# Altium project DSD_DTU.PrjPcb
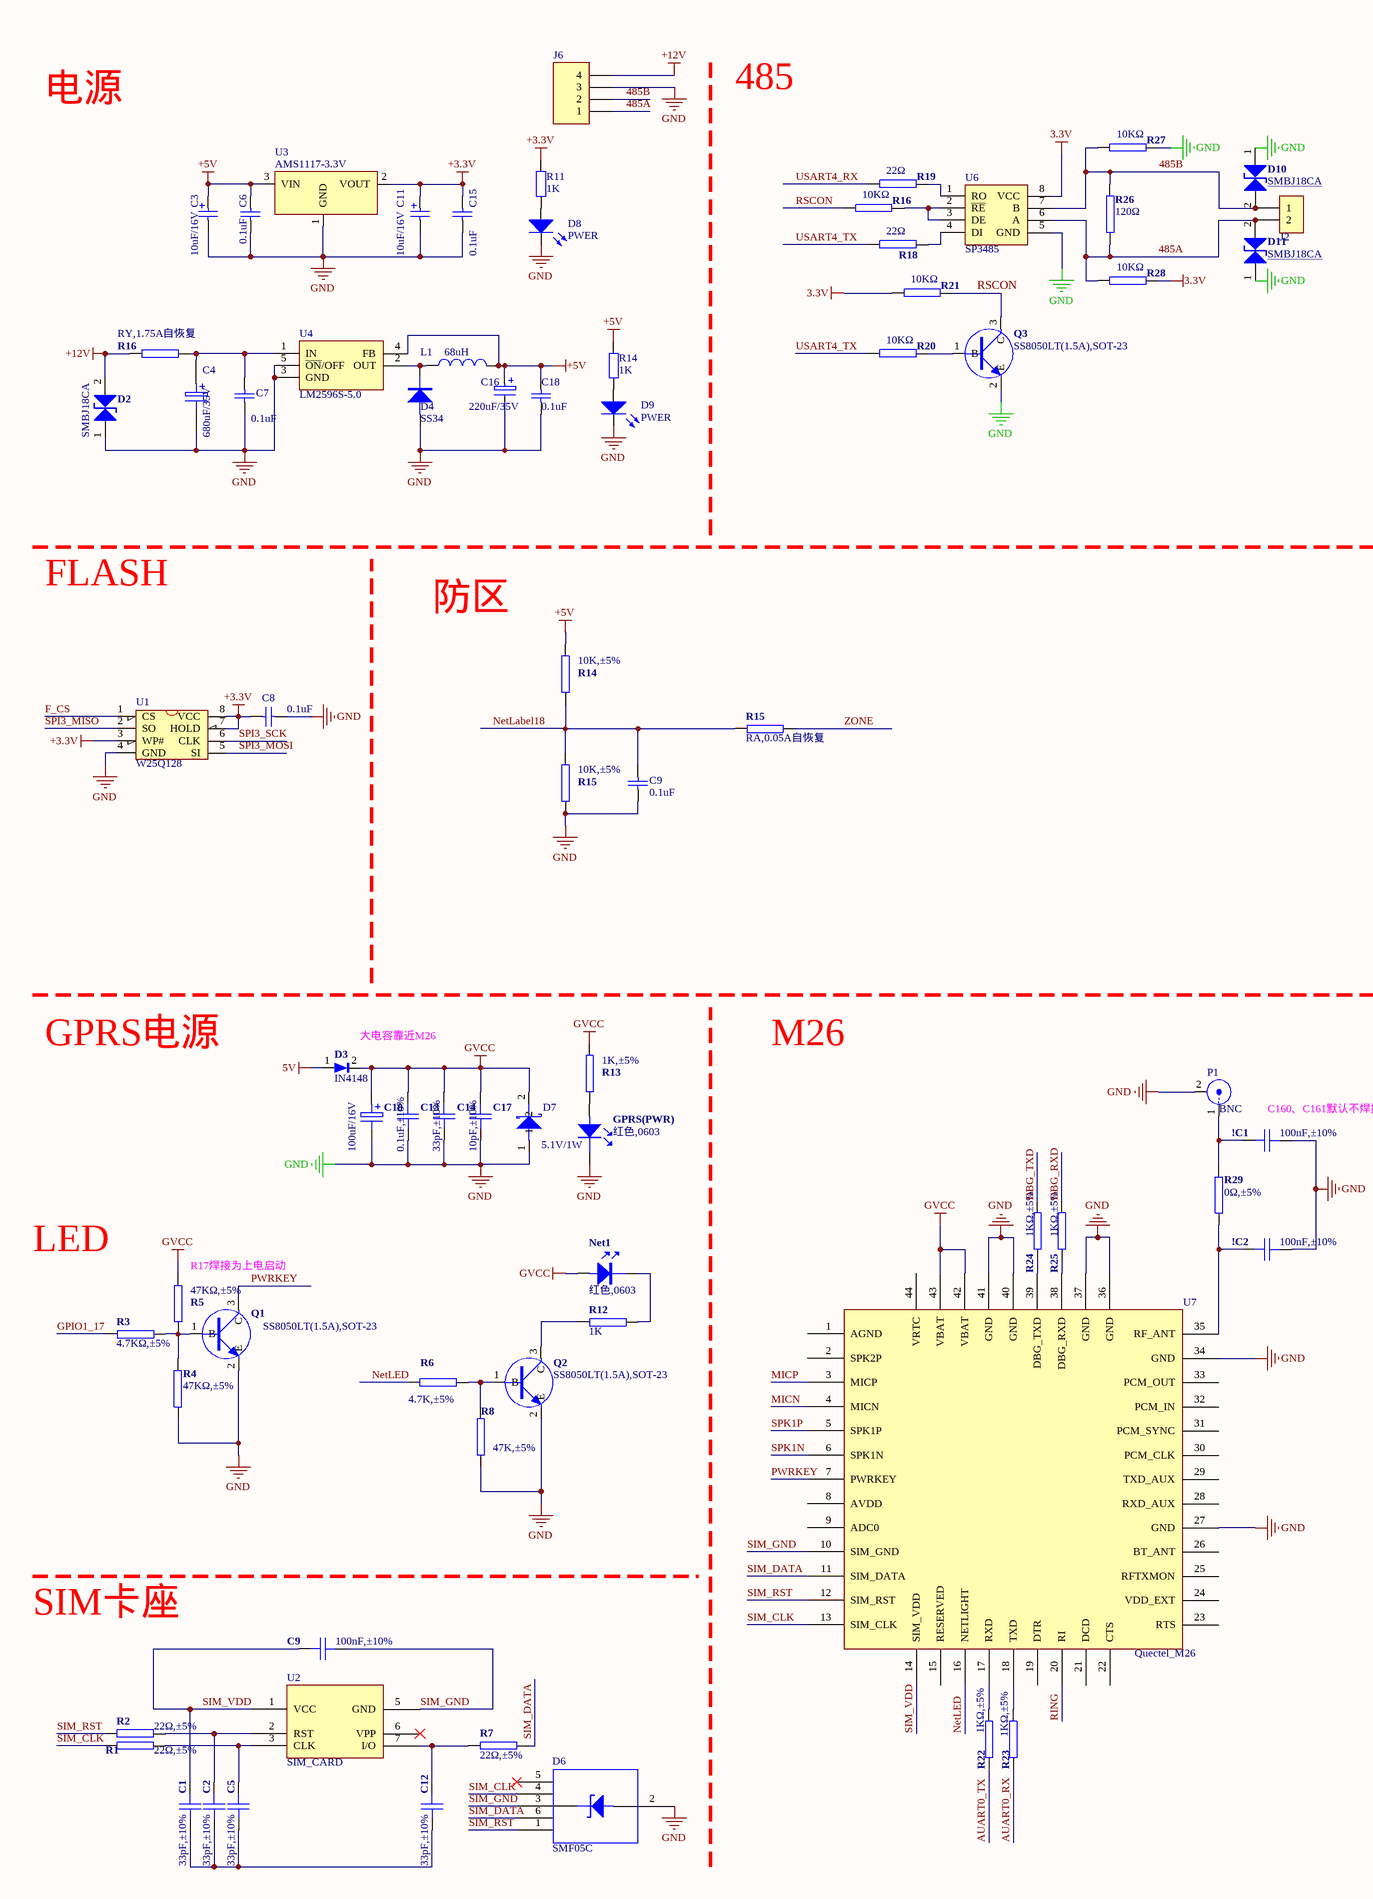
[diagram p0: DSD_DTU.SchDoc, left]
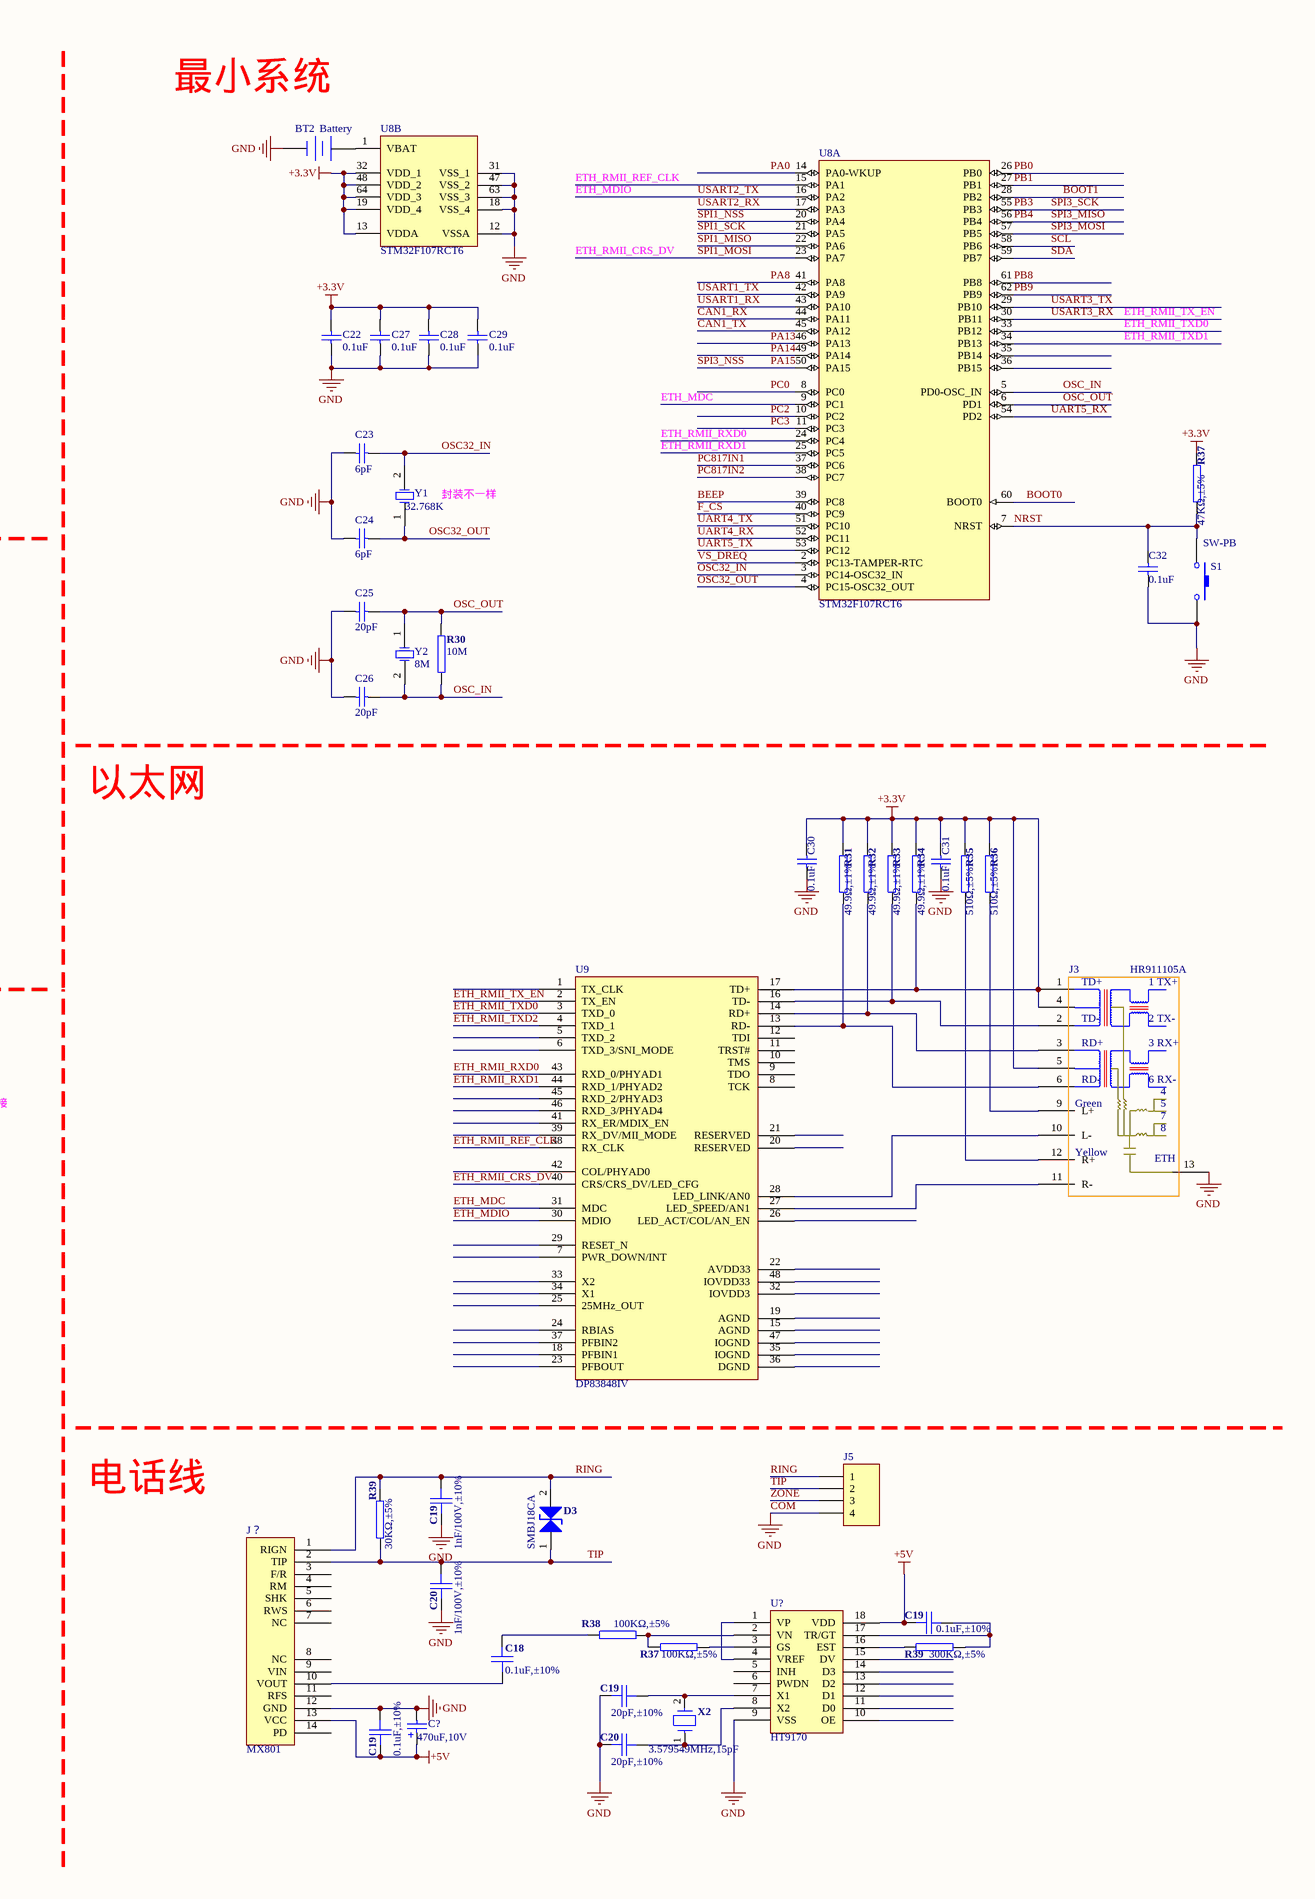
[diagram p1: DSD_DTU.SchDoc, right]
1 sheet, 117 parts. Net scope: global (net labels, ports and power ports of the same name join across sheets).

## Sheet DSD_DTU.SchDoc: DSD_DTU
size A2; Revision: V1.0

### Parts
(Parts that share a designator on the sheet are numbered #1, #2 ... from top to bottom, then left to right.)
!C1  100nF,±10%  [0603C]
!C2  100nF,±10%  [0603C]
BT2  Battery  [BATM]
C1  33pF,±10%  [0603C]
C2  33pF,±10%  [0603C]
C3  10uF/16V  [CAP6.3X7.7]
C4  680uF/35V  [CAPR5-4X5]
C5  33pF,±10%  [0603C]
C6  0.1uF  [0603C]
C7  0.1uF  [0603C]
C8  0.1uF  [0603C]
C9#1  0.1uF  [0603C]
C9#2  100nF,±10%  [0603C]
C10  100uF/16V  [CAPPRD250W45D630H800P]
C11  10uF/16V  [CAP6.3X7.7]
C12  33pF,±10%  [0603C]
C13  0.1uF,±10%  [0603C]
C14  33pF,±10%  [0603C]
C15  0.1uF  [0603C]
C16  220uF/35V  [CAPR5-4X5]
C17  10pF,±10%  [0603C]
C18#1  0.1uF  [0603C]
C18#2  0.1uF,±10%  [0603C]
C19#1  1nF/100V,±10%  [0603C]
C19#2  0.1uF,±10%  [0603C]
C19#3  20pF,±10%  [0603C]
C19#4  0.1uF,±10%  [0603C]
C20#1  1nF/100V,±10%  [0603C]
C20#2  20pF,±10%  [0603C]
C22  0.1uF  [0603C]
C23  6pF  [0603C]
C24  6pF  [0603C]
C25  20pF  [0603C]
C26  20pF  [0603C]
C27  0.1uF  [0603C]
C28  0.1uF  [0603C]
C29  0.1uF  [0603C]
C30  0.1uF  [0603C]
C31  0.1uF  [0603C]
C32  0.1uF  [0603C]
C?  470uF,10V  [1206CC]
D2  value SMBJ18CA  [SOD-1812]  (hidden comment: DIODE ZENER2)
D3#1  value IN4148  [SOD-SK34A]  (hidden comment: DIODE1)
D3#2  value SMBJ18CA  [SOD-1812]  (hidden comment: DIODE ZENER2)
D4  SS34  [DO-214AC]
D6  SMF05C  [SOT-363]
D7  value 5.1V/1W  [SOD-SK34A]  (hidden comment: DIODE SCHOTTKY)
D8  PWER  [LED-0603]
D9  PWER  [LED-0603]
D10  SMBJ18CA  [SOD-1812]
D11  SMBJ18CA  [SOD-1812]
GPRS(PWR)  value 红色,0603  [LED-0603]  (hidden comment: Error)
J2  CON2  [CON-2-5.08]  (value not drawn)
J3  HR911105A  [HR911105a]
J5  Header 4  [4PIN]  (value not drawn)
J6  Header 4  [4PIN]  (value not drawn)
J？  MX801  [MX801]
L1  68uH  [CDR74]
Net1  value 红色,0603  [LED-0603]  (hidden comment: Error)
P1  BNC  [SMB_V-RJ45]
Q1  SS8050LT(1.5A),SOT-23  [SOT-23]
Q2  value SS8050LT(1.5A),SOT-23  [SOT-23]  (hidden comment: NPN-1)
Q3  value SS8050LT(1.5A),SOT-23  [SOT-23]  (hidden comment: NPN-1)
R1  22Ω,±5%  [0603R]
R2  22Ω,±5%  [0603R]
R3  4.7KΩ,±5%  [0603R]
R4  47KΩ,±5%  [0603R]
R5  47KΩ,±5%  [0603R]
R6  4.7K,±5%  [0603R]
R7  22Ω,±5%  [0603R]
R8  47K,±5%  [0603R]
R11  1K  [0603R]
R12  1K  [0603R]
R13  1K,±5%  [0603R]
R14#1  1K  [0603R]
R14#2  10K,±5%  [0603R]
R15#1  RA,0.05A自恢复  [1206R]
R15#2  10K,±5%  [0603R]
R16#1  10KΩ  [0603R]
R16#2  RY,1.75A自恢复  [1210R]
R18  22Ω  [0603R]
R19  22Ω  [0603R]
R20  10KΩ  [0603R]
R21  10KΩ  [0603R]
R22  1KΩ,±5%  [0603R]
R23  1KΩ,±5%  [0603R]
R24  1KΩ,±5%  [0603R]
R25  1KΩ,±5%  [0603R]
R26  120Ω  [0603R]
R27  10KΩ  [0603R]
R28  10KΩ  [0603R]
R29  0Ω,±5%  [0603R]
R30  10M  [0603R]
R31  49.9Ω,±1%  [0603R]
R32  49.9Ω,±1%  [0603R]
R33  49.9Ω,±1%  [0603R]
R34  49.9Ω,±1%  [0603R]
R35  510Ω,±5%  [0603R]
R36  510Ω,±5%  [0603R]
R37#1  47KΩ,±5%  [0603R]
R37#2  100KΩ,±5%  [0603R]
R38  100KΩ,±5%  [0603R]
R39#1  30KΩ,±5%  [0603R]
R39#2  300KΩ,±5%  [0603R]
S1  SW-PB  [KEY-6S]
U1  W25Q128  [SOIC-8]
U2  SIM_CARD  [SIM_CARDMINI]
U3  AMS1117-3.3V  [SOT-223]
U4  LM2596S-5.0  [TO-263]
U6  SP3485  [SOP8]
U7  Quectel_M26  [Quectel_M26]
U8  STM32F107RCT6  [LQFP64_M]  (parts A,B of 2)
U9  DP83848IV  [TQFP48_N]
U?  HT9170  [SOIC-18]
X2  value 3.579549MHz,15pF  [XTAL2-3.2X1.5]  (hidden comment: XTAL)
Y1  32.768K  [XTAL32]
Y2  8M  [49SMD]

### Nets
3.3V: R21.2 R28.1 U6.8(VCC)
5V: D3#1.1
+3.3V: C8.1 C11.1 C15.1 C22.2 C27.2 C28.2 C29.2 C30.1 C31.1 J3.1 J3.4 J3.5 R11.1 R31.2 R32.2 R33.2 R34.1 R34.2 R35.2 R36.2 R37#1.1 U1.3(WP#) U1.7(HOLD) U1.8(VCC) U3.2(VOUT) U8.13(VDDA) U8.19(VDD_4) U8.32(VDD_1) U8.48(VDD_2) U8.64(VDD_3) U9.17(TD+)
+5V: C3.1 C6.1 C16.1 C18#1.1 C19#2.2 C19#4.1 C?.1 J？.13(VCC) L1.2 R14#1.1 R14#2.1 U3.3(VIN) U4.4(FB) U?.18(VDD)
+12V: D2.2(K) J6.4 R16#2.1
COM: !C1.2 !C2.2 BT2.2(-) C3.2 C4.2 C6.2 C7.2 C8.2 C9#1.1 C10.2 C11.2 C13.2 C14.2 C15.2 C16.2 C17.2 C18#1.2 C19#1.1 C19#3.2 C19#4.2 C20#1.1 C20#2.2 C22.1 C23.2 C24.2 C25.2 C26.2 C27.1 C28.1 C29.1 C30.2 C31.2 C32.2 C?.2 D2.1(A) D4.1(A) D6.2(K) D7.1 D8.2(K) D9.2(K) D10.1(A) D11.1(A) GPRS(PWR).2 J3.13 J5.4 J6.3 J？.12(GND) P1.2(Y) Q1.2(E) Q2.2(E) Q3.2(E) R4.1 R8.2 R15#2.2 R27.1 S1.2 U1.4(GND) U3.1(GND) U4.3(GND) U4.5(~{ON}/OFF) U6.5(GND) U7.27(GND) U7.34(GND) U7.36(GND) U7.37(GND) U7.40(GND) U7.41(GND) U8.12(VSSA) U8.18(VSS_4) U8.31(VSS_1) U8.47(VSS_2) U8.63(VSS_3) U?.9(VSS)  [also labelled GND]
GVCC: C10.1 C13.1 C14.1 C17.1 D3#1.2 D7.2 Net1.1 R5.1 R13.1 U7.42(VBAT) U7.43(VBAT)
485A: D11.2(K) J2.2 J6.1 R26.2 R28.2 U6.6(A)
485B: D10.2(K) J2.1 J6.2 R26.1 R27.2 U6.7(B)
AUART0_RX: R23.2
AUART0_TX: R22.2
BEEP: U8.39(PC8)
BOOT0: U8.60(BOOT0)
BOOT1: U8.28(PB2)
CAN1_RX: U8.44(PA11)
CAN1_TX: U8.45(PA12)
DBG_RXD: R25.1
DBG_TXD: R24.1
ETH_MDC: U8.9(PC1) U9.31(MDC)
ETH_MDIO: U8.16(PA2) U9.30(MDIO)  [also labelled USART2_TX]
ETH_RMII_CRS_DV: U8.23(PA7) U9.40(CRS/CRS_DV/LED_CFG)  [also labelled SPI1_MOSI]
ETH_RMII_REF_CLK: U8.15(PA1) U9.38(RX_CLK)
ETH_RMII_RXD0: U8.24(PC4) U9.43(RXD_0/PHYAD1)
ETH_RMII_RXD1: U8.25(PC5) U9.44(RXD_1/PHYAD2)
ETH_RMII_TX_EN: U8.30(PB11) U9.2(TX_EN)  [also labelled USART3_RX]
ETH_RMII_TXD0: U8.33(PB12) U9.3(TXD_0)
ETH_RMII_TXD1: U8.34(PB13)
ETH_RMII_TXD2: U9.4(TXD_1)
F_CS: U1.1(CS) U8.40(PC9)
GPIO1_17: R3.1
MICN: U7.4(MICN)
MICP: U7.3(MICP)
NetLabel18: C9#1.2 R14#2.2 R15#1.1 R15#2.1
NetLED: R6.2 U7.16(NETLIGHT)
NRST: C32.1 R37#1.2 S1.1 U8.7(NRST)
OSC32_IN: C23.1 U8.3(PC14-OSC32_IN) Y1.2(OSC2)
OSC32_OUT: C24.1 U8.4(PC15-OSC32_OUT) Y1.1(OSC1)
OSC_IN: C26.1 R30.2 U8.5(PD0-OSC_IN) Y2.2(OSC2)
OSC_OUT: C25.1 R30.1 U8.6(PD1) Y2.1(OSC1)
PA0: U8.14(PA0-WKUP)
PA8: U8.41(PA8)
PA13: U8.46(PA13)
PA14: U8.49(PA14)
PA15: U8.50(PA15)  [also labelled SPI3_NSS]
PB0: U8.26(PB0)
PB1: U8.27(PB1)
PB3: U1.6(CLK) U8.55(PB3)  [also labelled SPI3_SCK]
PB4: U1.2(SO) U8.56(PB4)  [also labelled SPI3_MISO]
PB8: U8.61(PB8)
PB9: U8.62(PB9)
PC0: U8.8(PC0)
PC2: U8.10(PC2)
PC3: U8.11(PC3)
PC817IN1: U8.37(PC6)
PC817IN2: U8.38(PC7)
PWRKEY: Q1.3(C) U7.7(PWRKEY)
RING: C19#1.2 D3#2.2(K) J5.1 J？.1(RIGN) R39#1.2 U7.20(RI)
RSCON: Q3.3(C) R16#1.2 R21.1
SCL: U8.58(PB6)
SDA: U8.59(PB7)
SIM_CLK: D6.4 R1.2 U7.13(SIM_CLK)
SIM_DATA: D6.6 R7.1 U7.11(SIM_DATA)
SIM_GND: C9#2.2 D6.3 U2.5(GND) U7.10(SIM_GND)
SIM_RST: D6.1(A) R2.2 U7.12(SIM_RST)
SIM_VDD: C1.1 C9#2.1 U2.1(VCC) U7.14(SIM_VDD)
SPI1_MISO: U8.22(PA6)
SPI1_NSS: U8.20(PA4)
SPI1_SCK: U8.21(PA5)
SPI3_MOSI: U1.5(SI) U8.57(PB5)
SPK1N: U7.6(SPK1N)
SPK1P: U7.5(SPK1P)
TIP: C20#1.2 D3#2.1(A) J5.2 J？.2(TIP) R39#1.1
UART4_RX: U8.52(PC11)
UART4_TX: U8.51(PC10)
UART5_RX: U8.54(PD2)
UART5_TX: U8.53(PC12)
USART1_RX: U8.43(PA10)
USART1_TX: U8.42(PA9)
USART2_RX: U8.17(PA3)
USART3_TX: U8.29(PB10)
USART4_RX: R19.2
USART4_TX: R18.2 R20.2
VS_DREQ: U8.2(PC13-TAMPER-RTC)
ZONE: J5.3 R15#1.2
Net!C1_1: !C1.1 P1.1(X) R29.2
Net!C2_1: !C2.1 R29.1 U7.35(RF_ANT)
NetBT2_1: BT2.1(+) U8.1(VBAT)
NetC1_2: C1.2 C2.2 C5.2 C12.2
NetC2_1: C2.1 R2.1 U2.2(RST)
NetC4_1: C4.1 C7.1 R16#2.2 U4.1(IN)
NetC5_1: C5.1 R1.1 U2.3(CLK)
NetC12_1: C12.1 R7.2 U2.7(I/O)
NetC18#2_1: C18#2.1 J？.10(VOUT)
NetC18#2_2: C18#2.2 R38.2
NetC19#2_1: C19#2.1 R39#2.1 U?.17(TR/GT)
NetC19#3_1: C19#3.1 U?.7(X1) X2.2
NetC20#2_1: C20#2.1 U?.8(X2) X2.1
NetD4_2: D4.2(K) L1.1 U4.2(OUT)
NetD8_1: D8.1(A) R11.2
NetD9_1: D9.1(A) R14#1.2
NetGPRS(PWR)_1: GPRS(PWR).1 R13.2
NetJ3_2: J3.2 R33.1 U9.16(TD-)
NetJ3_3: J3.3 R32.1 U9.14(RD+)
NetJ3_6: J3.6 R31.1 U9.13(RD-)
NetJ3_9: J3.9(L+) R36.1
NetJ3_10: J3.10(L-) U9.28(LED_LINK/AN0)
NetJ3_11: J3.11(R-) U9.27(LED_SPEED/AN1)
NetJ3_12: J3.12(R+) R35.1
NetNet1_2: Net1.2 R12.2
NetQ1_1: Q1.1(B) R3.2 R4.2 R5.2
NetQ2_1: Q2.1(B) R6.1 R8.1
NetQ2_3: Q2.3(C) R12.1
NetQ3_1: Q3.1(B) R20.1
NetR16#1_1: R16#1.1 U6.2(~{RE}) U6.3(DE)
NetR18_1: R18.1 U6.4(DI)
NetR19_1: R19.1 U6.1(RO)
NetR22_1: R22.1 U7.17(RXD)
NetR23_1: R23.1 U7.18(TXD)
NetR24_2: R24.2 U7.39(DBG_TXD)
NetR25_2: R25.2 U7.38(DBG_RXD)
NetR37#2_1: R37#2.1 U?.3(GS)
NetR37#2_2: R37#2.2 R38.1 U?.2(VN)
NetR39#2_2: R39#2.2 U?.16(EST)
NetU?_1: U?.1(VP) U?.4(VREF)

Not connected (* = marked no-connect by the designer): D6 5*; J？ 3(F/R) 4(RM) 5(SHK) 6(RWS) 7(NC) 8(NC) 9(VIN) 11(RFS) 14(PD); U2 6(VPP)*; U7 1(AGND) 2(SPK2P) 8(AVDD) 9(ADC0) 15(RESERVED) 19(DTR) 21(DCD) 22(CTS) 23(RTS) 24(VDD_EXT) 25(RFTXMON) 26(BT_ANT) 28(RXD_AUX) 29(TXD_AUX) 30(PCM_CLK) 31(PCM_SYNC) 32(PCM_IN) 33(PCM_OUT) 44(VRTC); U8 35(PB14) 36(PB15); U9 1(TX_CLK) 5(TXD_2) 6(TXD_3/SNI_MODE) 7(PWR_DOWN/INT) 8(TCK) 9(TDO) 10(TMS) 11(TRST#) 12(TDI) 15(AGND) 18(PFBIN1) 19(AGND) 20(RESERVED) 21(RESERVED) 22(AVDD33) 23(PFBOUT) 24(RBIAS) 25(25MHz_OUT) 26(LED_ACT/COL/AN_EN) 29(RESET_N) 32(IOVDD3) 33(X2) 34(X1) 35(IOGND) 36(DGND) 37(PFBIN2) 39(RX_DV/MII_MODE) 41(RX_ER/MDIX_EN) 42(COL/PHYAD0) 45(RXD_2/PHYAD3) 46(RXD_3/PHYAD4) 47(IOGND) 48(IOVDD33); U? 5(INH) 6(PWDN) 10(OE) 11(D0) 12(D1) 13(D2) 14(D3) 15(DV)

### Notes on the sheet
- 电源
- 485
- 最小系统
- (near Y1) 封装不一样
- FLASH
- 防区
- 以太网
- GPRS电源
- (near D3#1) 大电容靠近M26
- M26
- (near !C1) C160、C161默认不焊接
- LED
- (near R5) R17焊接为上电启动
- 电话线
- SIM卡座
- (in symbol HR911102) TD+; 1 TX+; TD-; 2 TX-; RD+; 3 RX+; RD-; 6 RX-; Green; 7; 8; Yellow; ETH

### Library data of the parts
!C1 !C2 C1 C2 C5 C9#2 C12-C14 C17 C18#2 C19#1-C19#4 C20#1 C20#2 = CAP1: 102,±10%,2KV,X7R,1206,*,RoHS; 物料代码: 1.02.03.0003; 名称: 电容; 封装: 1206; 设备封装名称: C1206_102_X7R_2KV_10%; 贴片和直插: SMT; RoHS: RoHS; 型号: 102,±10%,2KV,X7R; ComponentLink1Description: ErpDataInfo; ComponentLink1URL: http://erp.zlgmcu.com/ErpExt/ErpData/ListMateriel.aspx?pkey=1.02.03.0003
  !C1 !C2 C9#2: Value: 100nF,±10%
  C1 C2 C5 C12 C14: Value: 33pF,±10%
  C13 C18#2 C19#2 C19#4: Value: 0.1uF,±10%
  C17: Value: 10pF,±10%
  C19#1 C20#1: Value: 1nF/100V,±10%
  C19#3 C20#2: Value: 20pF,±10%
BT2 = Battery: Multicell Battery; Published: 24-Mar-1999; LatestRevisionDate: 17-Jul-2002; LatestRevisionNote: Re-released for DXP Platform.; PackageReference: BAT-2; Publisher: Altium Limited; PackageDescription: Battery; 2 Leads
C3 C11 = Cap Pol3: Polarized Capacitor (Surface Mount); Published: 8-Jun-2000; LatestRevisionDate: 17-Jul-2002; LatestRevisionNote: Re-released for DXP Platform.; PackageReference: 1206+; Publisher: Altium Limited
  C11: Value: 10uF/16V
C4 = ELECTRO1: Electrolytic Capacitor
C6 C7 C15 C18#1 C32 = C0805: Ceramic Chip Capacitor - Standard; PackageReference: 0805; Code_IPC: 2012[0805]; Value: 0.1uF
C8 C9#1 C22-C31 = Cap: Capacitor; Published: 8-Jun-2000; LatestRevisionDate: 17-Jul-2002; LatestRevisionNote: Re-released for DXP Platform.; PackageReference: RAD-0.3; Publisher: Altium Limited
C10 = CAP ELECTRO1: 220μF,16V,Ф6.3×7mm,,珠海华冠,RoHS; 物料代码: 1.02.11.0018; 名称: 电解电容; 贴片和直插: THT; PCB备注: Fcqh-Slq-Twrj-141216; 器件优选方案: 状态正常; 厂商: 珠海华冠; RoHS: RoHS; 型号: 220μF,16V,Ф6.3×7mm; ComponentLink1Description: ErpDataInfo; ComponentLink1URL: http://erp.zlgmcu.com/ErpExt/ErpData/ListMateriel.aspx?pkey=1.02.11.0018; Value: 100uF/16V
C16 = CE
C? = Cap Pol3: 大容量电容; Value: ？uF; Published: 8-Jun-2000; LatestRevisionDate: 17-Jul-2002; LatestRevisionNote: Re-released for DXP Platform.; PackageReference: 1206+; Publisher: Altium Limited
D2 D3#2 = DIODE ZENER2: SMBJ18CA,DO-214AA,君耀,RoHS; 物料代码: 1.04.03.0004; 名称: TVS管; 设备封装名称: DO-214AA_SMBJ18CA; 贴片和直插: SMT; 器件优选方案: 样品物料,谨慎选用; 封装: DO-214AA; 厂商: 君耀; RoHS: RoHS; 型号: SMBJ18CA; ComponentLink1Description: ErpDataInfo; ComponentLink1URL: http://erp.zlgmcu.com/ErpExt/ErpData/ListMateriel.aspx?pkey=1.04.03.0004
D3#1 = DIODE1: 1N4148,SOD-323,RoHS; 物料代码: 1.04.07.0027; 名称: 二极管; 设备封装名称: SOD-323_1N4148; 贴片和直插: SMT; 封装: SOD-323; RoHS: RoHS; 型号: 1N4148; ComponentLink1Description: ErpDataInfo; ComponentLink1URL: http://erp.zlgmcu.com/ErpExt/ErpData/ListMateriel.aspx?pkey=1.04.07.0027
D4 = DIODE
D7 = DIODE SCHOTTKY: 肖特基二极管 快恢复二极管; 物料代码: 1.04.07.0021; 名称: 二极管; 规格型号: SK34A-TP,DO-214AC,MCC,RoHS; 厂商: MCC; 贴片和直插: SMT; 封装: DO-214AC; 设备封装名称: DO-214AC_SK34A; 型号: SK34A-TP; RoHS: RoHS; ComponentLink1Description: ErpDataInfo; ComponentLink1URL: http://erp.zlgmcu.com/ErpExt/ErpData/ListMateriel.aspx?pkey=1.04.07.0021
D8 D9 = LED0: Typical INFRARED GaAs LED; Published: 8-Jun-2000; LatestRevisionDate: 08-Jul-2005; LatestRevisionNote: Mech Layer 1 removed.; PackageReference: LED2PIN; Publisher: Altium Limited
D10 D11 = 1.04.03.0004: SMBJ18CA,DO-214AA,君耀,RoHS; 名称: TVS管; 设备封装名称: DO-214AA_SMBJ18CA; 贴片和直插: SMT; 器件优选方案: 样品物料,谨慎选用; 物料代码: 1.04.03.0004; Value: SMBJ18CA; 封装: DO-214AA; 厂商: 君耀; RoHS: RoHS; 型号: SMBJ18CA; ComponentLink1Description: ErpDataInfo; ComponentLink1URL: http://erp.zlgmcu.com/ErpExt/ErpData/ListMateriel.aspx?pkey=1.04.03.0004
GPRS(PWR) Net1 = LED1: 红色,0603,0603,*,RoHS; 物料代码: 1.04.05.0008; 名称: 发光二极管; 封装: 0603; 设备封装名称: LED0603-RED; 贴片和直插: SMT; 器件优选方案: 优先选用; RoHS: RoHS; 型号: 红色,0603; ComponentLink1Description: ErpDataInfo; ComponentLink1URL: http://erp.zlgmcu.com/ErpExt/ErpData/ListMateriel.aspx?pkey=1.04.05.0008
J2 = 1.10.06.0027: 2EDGR/2EDGK-5.08-2P,DEGSON; 名称: 端子; 贴片和直插: THT; 物料代码: 1.10.06.0027; Value: 2EDGR/2EDGK-5.08-2P; 厂商: DEGSON; 型号: 2EDGR/2EDGK-5.08-2P; ComponentLink1Description: ErpDataInfo; ComponentLink1URL: http://erp.zlgmcu.com/ErpExt/ErpData/ListMateriel.aspx?pkey=1.10.06.0027
J3 = HR911102
J5 J6 = Header 4: Header, 4-Pin; LatestRevisionDate: 17-Jul-2002; LatestRevisionNote: Re-released for DXP Platform.; Publisher: Altium Limited
J？ = MX801: 电话线振铃模块
L1 = INDUCTOR
P1 = SMB: SMB Straight Connector; LatestRevisionDate: 17-Jul-2002; LatestRevisionNote: Re-released for DXP Platform.; Publisher: Altium Limited
Q1-Q3 = NPN-1: SS8050LT(1.5A),SOT-23,江苏长电,RoHS; 物料代码: 1.04.09.0001; 名称: 三极管; 设备封装名称: SOT-23_SS8050LT; 贴片和直插: SMT; 封装: SOT-23; 厂商: 江苏长电; RoHS: RoHS; 型号: SS8050LT(1.5A),SOT-23,江苏长电,RoHS; ComponentLink1Description: ErpDataInfo; ComponentLink1URL: http://erp.zlgmcu.com/ErpExt/ErpData/ListMateriel.aspx?pkey=1.04.09.0001
  Q1: Value: SS8050LT(1.5A),SOT-23
R1-R8 R12 R13 R14#2 R15#1 R15#2 R16#1 R16#2 R18-R30 R35 R36 R37#1 R37#2 R38 R39#1 R39#2 = RES2: 物料代码: 1.01.17.0015; 名称: 电阻; 封装: 0402; 设备封装名称: R0402_49.9R_1%; 厂商: RALEC; 型号: 49.9Ω,±1%; 贴片和直插: SMT; RoHS: RoHS; ComponentLink1Description: ErpDataInfo; ComponentLink1URL: http://erp.zlgmcu.com/ErpExt/ErpData/ListMateriel.aspx?pkey=1.01.17.0015
  R1 R2 R7: Value: 22Ω,±5%
  R3: Value: 4.7KΩ,±5%
  R4 R5 R37#1: Value: 47KΩ,±5%
  R6: Value: 4.7K,±5%
  R8: Value: 47K,±5%
  R12: Value: 1K
  R13: Value: 1K,±5%
  R14#2 R15#2: Value: 10K,±5%
  R15#1: Value: RA,0.05A自恢复
  R16#1 R20 R21 R27 R28: Value: 10KΩ
  R16#2: Value: RY,1.75A自恢复
  R18 R19: Value: 22Ω
  R22-R25: Value: 1KΩ,±5%
  R26: Value: 120Ω
  R29: Value: 0Ω,±5%
  R30: Value: 10M
  R35 R36: Value: 510Ω,±5%
  R37#2 R38: Value: 100KΩ,±5%
  R39#1: Value: 30KΩ,±5%
  R39#2: Value: 300KΩ,±5%
R11 R14#1 = Res2: Resistor; Published: 8-Jun-2000; LatestRevisionDate: 17-Jul-2002; LatestRevisionNote: Re-released for DXP Platform.; PackageReference: 1206; Publisher: Altium Limited
R31-R34 = RES2: 物料代码: 1.01.17.0015; 名称: 电阻; 封装: 0402; 设备封装名称: R0402_49.9R_1%; 厂商: RALEC; 贴片和直插: SMT; RoHS: RoHS; 型号: 49.9Ω,±1%; ComponentLink1Description: ErpDataInfo; ComponentLink1URL: http://erp.zlgmcu.com/ErpExt/ErpData/ListMateriel.aspx?pkey=1.01.17.0015; Value: 49.9Ω,±1%
S1 = SW-PB: Switch; Published: 24-Mar-1999; LatestRevisionDate: 17-Jul-2002; LatestRevisionNote: Re-released for DXP Platform.; PackageReference: SPST-2; Publisher: Altium Limited; PackageDescription: Switch; 2 Leads
U1 = W25X16: W25X16;SST25VF016;MX25L1605
U3 = LM1117
U4 = LM2596S-5.0: Simple Switcher Power Converter 150 kHz 3A Step Down Voltage Regulator; Note: Tab is connected to GND; Published: 15-Apr-2002; DatasheetVersion: Dec-1997; PackageReference: TS5B; Publisher: Altium Limited; PackageDescription: D2-PAK; 5 Leads; Body 14.4 (inc. leads) x 10.4 mm (LxW max); ComponentLink1Description: Manufacturer Link; ComponentLink1URL: http://www.national.com/; ComponentLink2Description: Datasheet; ComponentLink2URL: http://www.national.com/ds.cgi/LM/LM2596.pdf; ComponentLink3Description: URL Link1; ComponentLink3URL: http://www.national.com/pf/LM/LM2596.html
U6 = MAX
U8 = STM32F107RCT6: STM32 ARM-based 32-bit MCU Connectivity Line & Ethernet with 256 kB Flash, 64 kB Internal RAM, -40 to +85癈 Temperature, 64-Pin LQFP, Tray; DatasheetVersion: rev5.0, May-2010; PackageVersion: rev13, Apr-2011; PackageReference: LQFP64; PackageDescription: 64-Pin Low-Profile Quad Flat Pack, 10 x 10 mm Body, 0.5 mm Pitch (LQFP64); ComponentLink1Description: Manufacturer URL; ComponentLink1URL: http://www.st.com/; ComponentLink2Description: STM32F105/107 Datasheet; ComponentLink2URL: http://www.st.com/internet/com/TECHNICAL_RESOURCES/TECHNICAL_LITERATURE/DATASHEET/CD00220364.pdf; ComponentLink3Description: STM32 Family Web Page; ComponentLink3URL: www.st.com/stm32
U9 = DP83848I: 网络芯片
U? = HT9170: 双音多频
X2 = 1.07.02.0056: 32.768kHz,15pF,±12.5ppm,SMD3215,EPSON,RoHS; 名称: 晶体(临时); 贴片和直插: SMT; 器件优选方案: 样品物料,谨慎选用; 物料代码: 1.07.02.0056; 封装: SMD3215; 厂商: EPSON; RoHS: RoHS; 型号: 32.768kHz,15pF,±12.5ppm; ComponentLink1Description: ErpDataInfo; ComponentLink1URL: http://erp.zlgmcu.com/ErpExt/ErpData/ListMateriel.aspx?pkey=1.07.02.0056
Y1 Y2 = XTAL: Crystal Oscillator; Published: 8-Jun-2000; LatestRevisionDate: 17-Jul-2002; LatestRevisionNote: Re-released for DXP Platform.; PackageReference: R38; Publisher: Altium Limited; PackageDescription: Crystal, Thru-Hole; 2 Leads; Body 3.1 x 8.2 mm (Dia.xH)